# Altium schematic sheet power.SchDoc
size A4 portrait
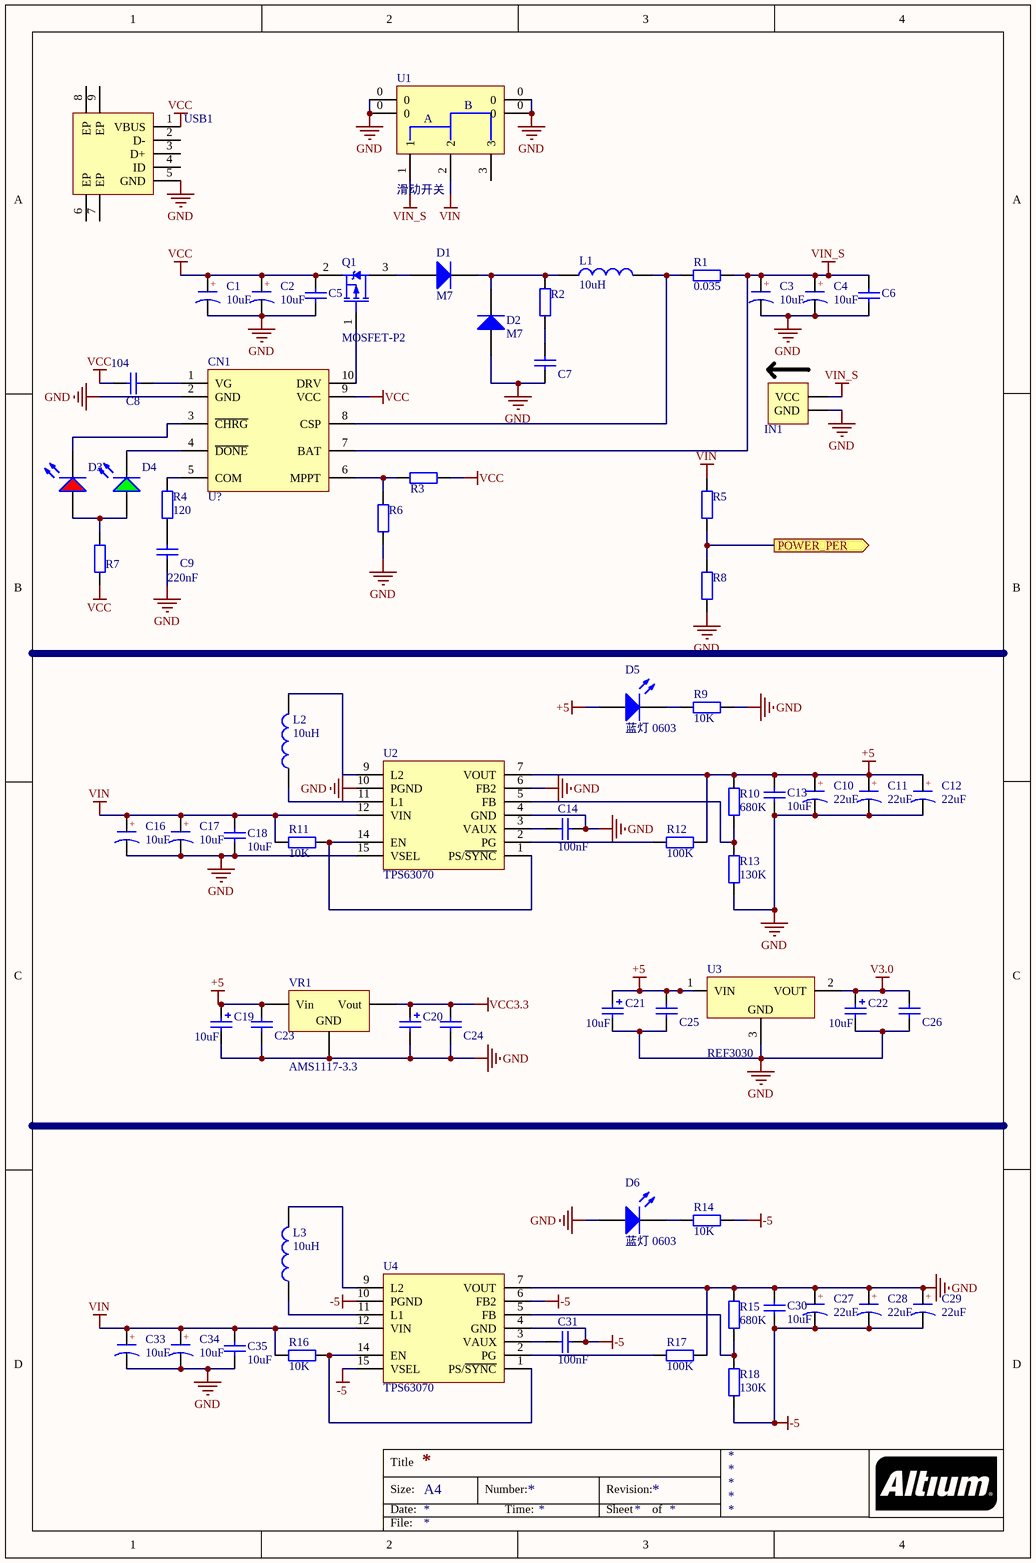
[diagram p0: power.SchDoc]

## Parts
C1  value 10uF  [226C]  (hidden comment: CAP+)
C2  value 10uF  [226C]  (hidden comment: CAP+)
C3  value 10uF  [226C]  (hidden comment: CAP+)
C4  value 10uF  [226C]  (hidden comment: CAP+)
C5  10nF (103) 10% 50V  [0603_C]  (value not drawn)
C6  10nF (103) 10% 50V  [0603_C]  (value not drawn)
C7  10nF (103) 10% 50V  [0603_C]  (value not drawn)
C8  104  [0603_C]
C9  220nF  [0603_C]
C10  value 22uF  [226C]  (hidden comment: CAP+)
C11  value 22uF  [226C]  (hidden comment: CAP+)
C12  value 22uF  [226C]  (hidden comment: CAP+)
C13  10uF  [0603_C]
C14  100nF  [0603_C]
C16  value 10uF  [226C]  (hidden comment: CAP+)
C17  value 10uF  [226C]  (hidden comment: CAP+)
C18  10uF  [0603_C]
C19  10uF  [CASE-A_3216]
C20  10uF (106) ±10% 16V  [CASE-A_3216]  (value not drawn)
C21  10uF  [CASE-A_3216]
C22  10uF  [CASE-A_3216]
C23  100nF (104) 10% 50V  [0603_C]  (value not drawn)
C24  100nF (104) 10% 50V  [0603_C]  (value not drawn)
C25  100nF (104) 10% 50V  [0603_C]  (value not drawn)
C26  100nF (104) 10% 50V  [0603_C]  (value not drawn)
C27  value 22uF  [226C]  (hidden comment: CAP+)
C28  value 22uF  [226C]  (hidden comment: CAP+)
C29  value 22uF  [226C]  (hidden comment: CAP+)
C30  10uF  [0603_C]
C31  100nF  [0603_C]
C33  value 10uF  [226C]  (hidden comment: CAP+)
C34  value 10uF  [226C]  (hidden comment: CAP+)
C35  10uF  [0603_C]
CN1  U?  [SSOP_10]
D1  M7  [SMA(DO-214AC)_S1]
D2  M7  [SMA(DO-214AC)_S1]
D3  红灯 0603  [0603_LED_S1]  (value not drawn)
D4  绿灯 0603  [0603_LED_S1]  (value not drawn)
D5  蓝灯 0603  [0603_LED_S1]
D6  蓝灯 0603  [0603_LED_S1]
IN1  HDR-1X2  [Power_IN_3.81-2P]  (value not drawn)
L1  value 10uH  [L8*8*4]  (hidden comment: IND)
L2  value 10uH  [L_6*6*2]  (hidden comment: IND)
L3  value 10uH  [L_6*6*2]  (hidden comment: IND)
Q1  MOSFET-P2  [SOT23-3M]
R1  0.035  [R 2512_L]
R2  100Ω (1000) ±1%  [0603_R]  (value not drawn)
R3  100Ω (1000) ±1%  [0603_R]  (value not drawn)
R4  120  [0603_R]
R5  100Ω (1000) ±1%  [0603_R]  (value not drawn)
R6  100Ω (1000) ±1%  [0603_R]  (value not drawn)
R7  100Ω (1000) ±1%  [0603_R]  (value not drawn)
R8  100Ω (1000) ±1%  [0603_R]  (value not drawn)
R9  10K  [0603_R]
R10  680K  [0603_R]
R11  10K  [0603_R]
R12  100K  [0603_R]
R13  130K  [0603_R]
R14  10K  [0603_R]
R15  680K  [0603_R]
R16  10K  [0603_R]
R17  100K  [0603_R]
R18  130K  [0603_R]
U1  滑动开关  [SW-SMD_3P-L6.6-W2.7-P1.50 - duplicate]
U2  TPS63070  [TPS63070]
U3  REF3030  [SOT23-3N]
U4  TPS63070  [TPS63070]
USB1  PORT_micro-5P破板式  [micro-5P破板式]  (value not drawn)
VR1  AMS1117-3.3  [SOT-223]

## Ports
POWER_PER (out)

## Nets
+5: C10.1(A) C11.1(A) C12.1(A) C13.2 C19.1 C21.1 C23.1 C25.1 D5.A R10.2 R12.1 U2.7(VOUT) U3.1(VIN) VR1.3(Vin)
-5: C27.2(K) C28.2(K) C29.2(K) C30.1 C31.1 R14.2 R18.1 U4.4(GND) U4.6(FB2) U4.10(PGND) U4.15(VSEL)
GND: C1.2(K) C2.2(K) C3.2(K) C4.2(K) C5.1 C6.1 C7.2 C9.2 C10.2(K) C11.2(K) C12.2(K) C13.1 C14.1 C16.2(K) C17.2(K) C18.1 C19.2 C20.2 C21.2 C22.2 C23.2 C24.2 C25.2 C26.2 C27.1(A) C28.1(A) C29.1(A) C30.2 C33.2(K) C34.2(K) C35.1 CN1.2(GND) D2.1(A) D6.A IN1.2(GND) R6.1 R8.1 R9.2 R13.1 R15.2 R17.1 U1.0 U2.4(GND) U2.6(FB2) U2.10(PGND) U2.15(VSEL) U3.3(GND) U4.7(VOUT) USB1.5(GND) VR1.1(GND)
V3.0: C22.1 C26.1 U3.2(VOUT)
VCC: C1.1(A) C2.1(A) C5.2 C8.2 CN1.9(VCC) Q1.2(S) R3.1 R7.2 USB1.1(VBUS)
VCC3.3: C20.1 C24.1 VR1.2(Vout)
VIN: C16.1(A) C17.1(A) C18.2 C33.1(A) C34.1(A) C35.2 R5.2 R11.1 R16.1 U1.2 U2.12(VIN) U4.12(VIN)
VIN_S: C3.1(A) C4.1(A) C6.2 CN1.7(BAT) IN1.1(VCC) R1.1 U1.1
POWER_PER: R5.1 R8.2 ; port POWER_PER
NetC7_1: C7.1 R2.1
NetC8_1: C8.1 CN1.1(VG)
NetC9_1: C9.1 R4.1
NetC14_2: C14.2 U2.3(VAUX)
NetC31_2: C31.2 U4.3(VAUX)
NetCN1_3: CN1.3(~{CHRG}) D3.K
NetCN1_4: CN1.4(~{DONE}) D4.K
NetCN1_5: CN1.5(COM) R4.2
NetCN1_6: CN1.6(MPPT) R3.2 R6.2
NetCN1_8: CN1.8(CSP) L1.2 R1.2
NetCN1_10: CN1.10(DRV) Q1.1(G)
NetD1_1: D1.1(A) Q1.3(D)
NetD1_2: D1.2(K) D2.2(K) L1.1 R2.2
NetD3_A: D3.A D4.A R7.1
NetD5_K: D5.K R9.1
NetD6_K: D6.K R14.1
NetL2_1: L2.1 U2.11(L1)
NetL2_2: L2.2 U2.9(L2)
NetL3_1: L3.1 U4.11(L1)
NetL3_2: L3.2 U4.9(L2)
NetR10_1: R10.1 R13.2 U2.5(FB)
NetR11_2: R11.2 U2.1(PS/~{SYNC}) U2.14(EN)
NetR12_2: R12.2 U2.2(PG)
NetR15_1: R15.1 R18.2 U4.5(FB)
NetR16_2: R16.2 U4.1(PS/~{SYNC}) U4.14(EN)
NetR17_2: R17.2 U4.2(PG)

Not connected (* = marked no-connect by the designer): U1 3; USB1 2(D-) 3(D+) 4(ID) 6(EP) 7(EP) 8(EP) 9(EP)

## Notes on the sheet
- Title
- Size:
- Date:
- A4
- Number:
- Time:
- Revision:
- Sheet
- of
- File:
- (in symbol 0CAP+) +
- (in symbol TA_6.6*2.7*2.5_滑动开关) B; A

## Library data of the parts
C1-C4 C10-C12 C16 C17 C27-C29 C33 C34 = 0CAP+: 贴片钽电容
C5-C9 = 0603 10nF (103) 10% 50V: 贴片电容; ComponentLink1Description: 供应商链接; ComponentLink1URL: http://www.szlcsc.com/product/details_58143.html; Package: 0603; Supplier: LC; SuppliersPartNumber: C57112
C13 C14 C18 C30 C31 C35 = 0603 10uF (106) 10% 10V: 贴片电容; ComponentLink1Description: 供应商链接; ComponentLink1URL: http://www.szlcsc.com/product/details_20411.html; Package: 0603; Supplier: LC; SuppliersPartNumber: C19702
C19-C22 = 3216 10uF (106) 10% 16V: 钽电容; ComponentLink1Description: 供应商链接; ComponentLink1URL: http://www.szlcsc.com/product/details_7643.html; Package: 3216; Supplier: LC; SuppliersPartNumber: C7171
C23-C26 = 0603 100nF (104) 10% 50V: 贴片电容; ComponentLink1Description: 供应商链接; ComponentLink1URL: http://www.szlcsc.com/product/details_15331.html; Package: 0603; Supplier: LC; SuppliersPartNumber: C14663
CN1 = CN3791
D1 D2 = SMA(DO-214AC) M7: 二极管; Notepad: 1N4007 4007 编号C2464 已经停售, 使用新物料编号C95872; ComponentLink1Description: 供应商链接; ComponentLink1URL: http://www.szlcsc.com/product/details_2841.html; Package: SMA(DO-214AC); Supplier: LC; SuppliersPartNumber: C95872
D3 = 0603 红灯: 发光二极管; ComponentLink1Description: 供应商链接; ComponentLink1URL: http://www.szlcsc.com/product/details_2659.html; Package: 0603; Supplier: LC; SuppliersPartNumber: C2286
D4 = 0603 绿灯: 发光二极管; ComponentLink1Description: 供应商链接; ComponentLink1URL: http://www.szlcsc.com/product/details_73152.html; Package: 0603; Supplier: LC; SuppliersPartNumber: C72043
D5 D6 = 0603 蓝灯: 发光二极管; ComponentLink1Description: 供应商链接; ComponentLink1URL: http://www.szlcsc.com/product/details_73150.html; Package: 0603; Supplier: LC; SuppliersPartNumber: C72041
IN1 = PORT_Power_IN2: 2P接插件,模块单电源供电口; 版权归属: 源创客; BOM名称: 2P接插件; 学习资源: www.ooocke.com
L1-L3 = 0IND: 小功率贴片电感
Q1 = MOS_MOSFET-P2: P-Channel MOSFET; PackageDocument: 1995/1996; Published: 8-Jun-2000; LatestRevisionDate: 17-Jul-2002; LatestRevisionNote: Re-released for DXP Platform.; PackageReference: E3; Publisher: Altium Limited
R1-R8 = 0603 100Ω (1000) 1%: 贴片电阻; ComponentLink1Description: 供应商链接; ComponentLink1URL: http://www.szlcsc.com/product/details_23502.html; Package: 0603; Supplier: LC; SuppliersPartNumber: C22775
R9-R18 = 0603 1.2KΩ (1201) 1%: 贴片电阻; ComponentLink1Description: 供应商链接; ComponentLink1URL: http://www.szlcsc.com/product/details_23492.html; Package: 0603; Supplier: LC; SuppliersPartNumber: C22765
U1 = TA_6.6*2.7*2.5_滑动开关
U3 = REF3040
VR1 = SOT-223 AMS1117-3.3: 低压差线性稳压(LDO); ComponentLink1Description: 供应商链接; ComponentLink1URL: http://www.szlcsc.com/product/details_6652.html; Package: SOT-223; Supplier: LC; SuppliersPartNumber: C6186